# EAGLE design atmega32u4-breakout-v2 (EAGLE 5.10)
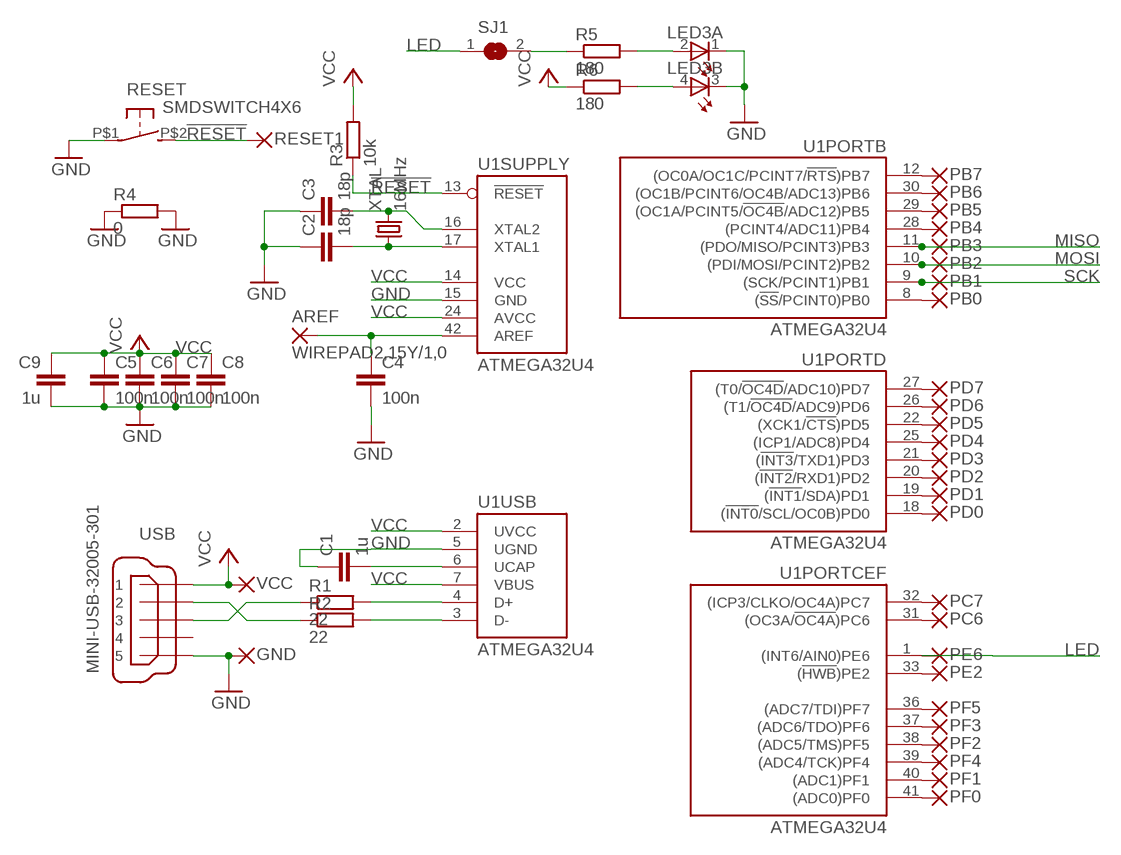
[diagram p0: schematic, sheet 1]

## Parts
AREF  WIREPAD2,15Y/1,0  [2,15Y/1,0]
C1  1u  C-EUC0603  [C0603]
C2  18p  C-EUC0603  [C0603]
C3  18p  C-EUC0603  [C0603]
C4  100n  C-EUC0603  [C0603]
C5  100n  C-EUC0603  [C0603]
C6  100n  C-EUC0603  [C0603]
C7  100n  C-EUC0603  [C0603]
C8  100n  C-EUC0603  [C0603]
C9  1u  C-EUC0603K  [C0603K]
GND  WIREPAD2,15Y/1,0  [2,15Y/1,0]
LED3  TOPLED-2-/  [P-LCC-4/2]
PB0  WIREPAD2,15Y/1,0  [2,15Y/1,0]
PB1  WIREPAD2,15Y/1,0  [2,15Y/1,0]
PB2  WIREPAD2,15Y/1,0  [2,15Y/1,0]
PB3  WIREPAD2,15Y/1,0  [2,15Y/1,0]
PB4  WIREPAD2,15Y/1,0  [2,15Y/1,0]
PB5  WIREPAD2,15Y/1,0  [2,15Y/1,0]
PB6  WIREPAD2,15Y/1,0  [2,15Y/1,0]
PB7  WIREPAD2,15Y/1,0  [2,15Y/1,0]
PC6  WIREPAD2,15Y/1,0  [2,15Y/1,0]
PC7  WIREPAD2,15Y/1,0  [2,15Y/1,0]
PD0  WIREPAD2,15Y/1,0  [2,15Y/1,0]
PD1  WIREPAD2,15Y/1,0  [2,15Y/1,0]
PD2  WIREPAD2,15Y/1,0  [2,15Y/1,0]
PD3  WIREPAD2,15Y/1,0  [2,15Y/1,0]
PD4  WIREPAD2,15Y/1,0  [2,15Y/1,0]
PD5  WIREPAD2,15Y/1,0  [2,15Y/1,0]
PD6  WIREPAD2,15Y/1,0  [2,15Y/1,0]
PD7  WIREPAD2,15Y/1,0  [2,15Y/1,0]
PE2  WIREPAD2,15Y/1,0  [2,15Y/1,0]
PE6  WIREPAD2,15Y/1,0  [2,15Y/1,0]
PF0  WIREPAD2,15Y/1,0  [2,15Y/1,0]
PF1  WIREPAD2,15Y/1,0  [2,15Y/1,0]
PF2  WIREPAD2,15Y/1,0  [2,15Y/1,0]
PF3  WIREPAD2,15Y/1,0  [2,15Y/1,0]
PF4  WIREPAD2,15Y/1,0  [2,15Y/1,0]
PF5  WIREPAD2,15Y/1,0  [2,15Y/1,0]
R1  22  R-EU_R0603  [R0603]
R2  22  R-EU_R0603  [R0603]
R3  10k  R-EU_R0603  [R0603]
R4  0  R-EU_R0603  [R0603]
R5  180  R-EU_R0603  [R0603]
R6  180  R-EU_R0603  [R0603]
RESET  SMDSWITCH4X6  [SWSMD4X6]
RESET1  WIREPAD2,15Y/1,0  [2,15Y/1,0]
SJ1  SJ  [SJ]
U1  ATMEGA32U4  ATMEGAXU4  [TQFP44]
USB  MINI-USB-32005-301  [32005-301]
VCC  WIREPAD2,15Y/1,0  [2,15Y/1,0]
XTAL  16MHz  CRYSTALCS10  [CS10]

## Nets
!RESET: R3.1 RESET1.1(P) RESET.P$2(S) U1.13(SUPPLY:!RESET)
AREF: AREF.1(P) C4.1 U1.42(SUPPLY:AREF)
GND: C1.1 C2.1 C3.1 C4.2 C5.2 C6.2 C7.2 C8.2 C9.2 GND.1(P) LED3.1(A:C) LED3.3(B:C) R4.1 R4.2 RESET.P$1(P) U1.5(USB:UGND) U1.15(SUPPLY:GND) USB.5
LED: PE6.1(P) SJ1.1 U1.1(PORTCEF:(INT6/AIN0)PE6)
MISO: PB3.1(P) U1.11(PORTB:(PDO/MISO/PCINT3)PB3)
MOSI: PB2.1(P) U1.10(PORTB:(PDI/MOSI/PCINT2)PB2)
N$1: R1.1 USB.3
N$2: R2.1 USB.2
N$3: PB0.1(P) U1.8(PORTB:(!SS!/PCINT0)PB0)
N$4: R5.1 SJ1.2
N$5: C2.2 U1.17(SUPPLY:XTAL1) XTAL.P$1
N$6: C3.2 U1.16(SUPPLY:XTAL2) XTAL.P$2
N$7: C1.2 U1.6(USB:UCAP)
N$8: LED3.2(A:A) R5.2
N$9: R1.2 U1.4(USB:D+)
N$10: R2.2 U1.3(USB:D-)
N$11: LED3.4(B:A) R6.2
N$12: PD5.1(P) U1.22(PORTD:(XCK1/!CTS!)PD5)
N$13: PB4.1(P) U1.28(PORTB:(PCINT4/ADC11)PB4)
N$14: PB5.1(P) U1.29(PORTB:(OC1A/PCINT5/!OC4B!/ADC12)PB5)
N$15: PF0.1(P) U1.41(PORTCEF:(ADC0)PF0)
N$16: PF1.1(P) U1.40(PORTCEF:(ADC1)PF1)
N$17: PF4.1(P) U1.39(PORTCEF:(ADC4/TCK)PF4)
N$18: PF2.1(P) U1.38(PORTCEF:(ADC5/TMS)PF5)
N$19: PF3.1(P) U1.37(PORTCEF:(ADC6/TDO)PF6)
N$20: PF5.1(P) U1.36(PORTCEF:(ADC7/TDI)PF7)
N$21: PE2.1(P) U1.33(PORTCEF:(!HWB!)PE2)
N$23: PC6.1(P) U1.31(PORTCEF:(OC3A/!OC4A!)PC6)
N$24: PC7.1(P) U1.32(PORTCEF:(ICP3/CLKO/OC4A)PC7)
N$25: PB6.1(P) U1.30(PORTB:(OC1B/PCINT6/OC4B/ADC13)PB6)
N$26: PB7.1(P) U1.12(PORTB:(OC0A/OC1C/PCINT7/!RTS!)PB7)
N$27: PD0.1(P) U1.18(PORTD:(!INT0!/SCL/OC0B)PD0)
N$28: PD1.1(P) U1.19(PORTD:(!INT1!/SDA)PD1)
N$29: PD2.1(P) U1.20(PORTD:(!INT2!/RXD1)PD2)
N$30: PD3.1(P) U1.21(PORTD:(!INT3!/TXD1)PD3)
N$31: PD4.1(P) U1.25(PORTD:(ICP1/ADC8)PD4)
N$33: PD6.1(P) U1.26(PORTD:(T1/!OC4D!/ADC9)PD6)
N$34: PD7.1(P) U1.27(PORTD:(T0/!OC4D!/ADC10)PD7)
SCK: PB1.1(P) U1.9(PORTB:(SCK/PCINT1)PB1)
VCC: C5.1 C6.1 C7.1 C8.1 C9.1 R3.2 R6.1 U1.2(USB:UVCC) U1.7(USB:VBUS) U1.14(SUPPLY:VCC) U1.24(SUPPLY:AVCC) USB.1 VCC.1(P)
Unconnected: USB.4

## Power pins joined to a net without a drawn wire
GND: U1.23(GND) U1.35(GND) U1.43(GND)
VCC: U1.34(VCC) U1.44(AVCC)

## Library data of the parts
AREF GND PB0 PB1-PB7 PC6 PC7 PD0 PD1-PD7 PE2 PE6 PF0 PF1-PF5 RESET1 VCC = jocki:WIREPAD: Wire PAD connect wire on PCB
C1-C9 = rcl:C-EU: CAPACITOR, European symbol
LED3 = jocki:TOPLED-2-: Multi TOPLED® (two color) LG T672, LP T672 LSY T67B LSW T67C LSY T675 LSY T676 LSG T677 LSG T770 Source: http://www.osram.convergy.de/
R1-R6 = rcl:R-EU_: RESISTOR, European symbol
RESET = jocki:SMDSWITCH
SJ1 = jumper:SJ: SMD solder JUMPER
U1 = jocki:ATMEGAXU4: Atmel Atmega16U4 or Atmega32U4
USB = jocki:MINI-USB-: MINI USB-B Conector Source: www.cypressindustries.com
XTAL = jocki:CRYSTAL

## Board
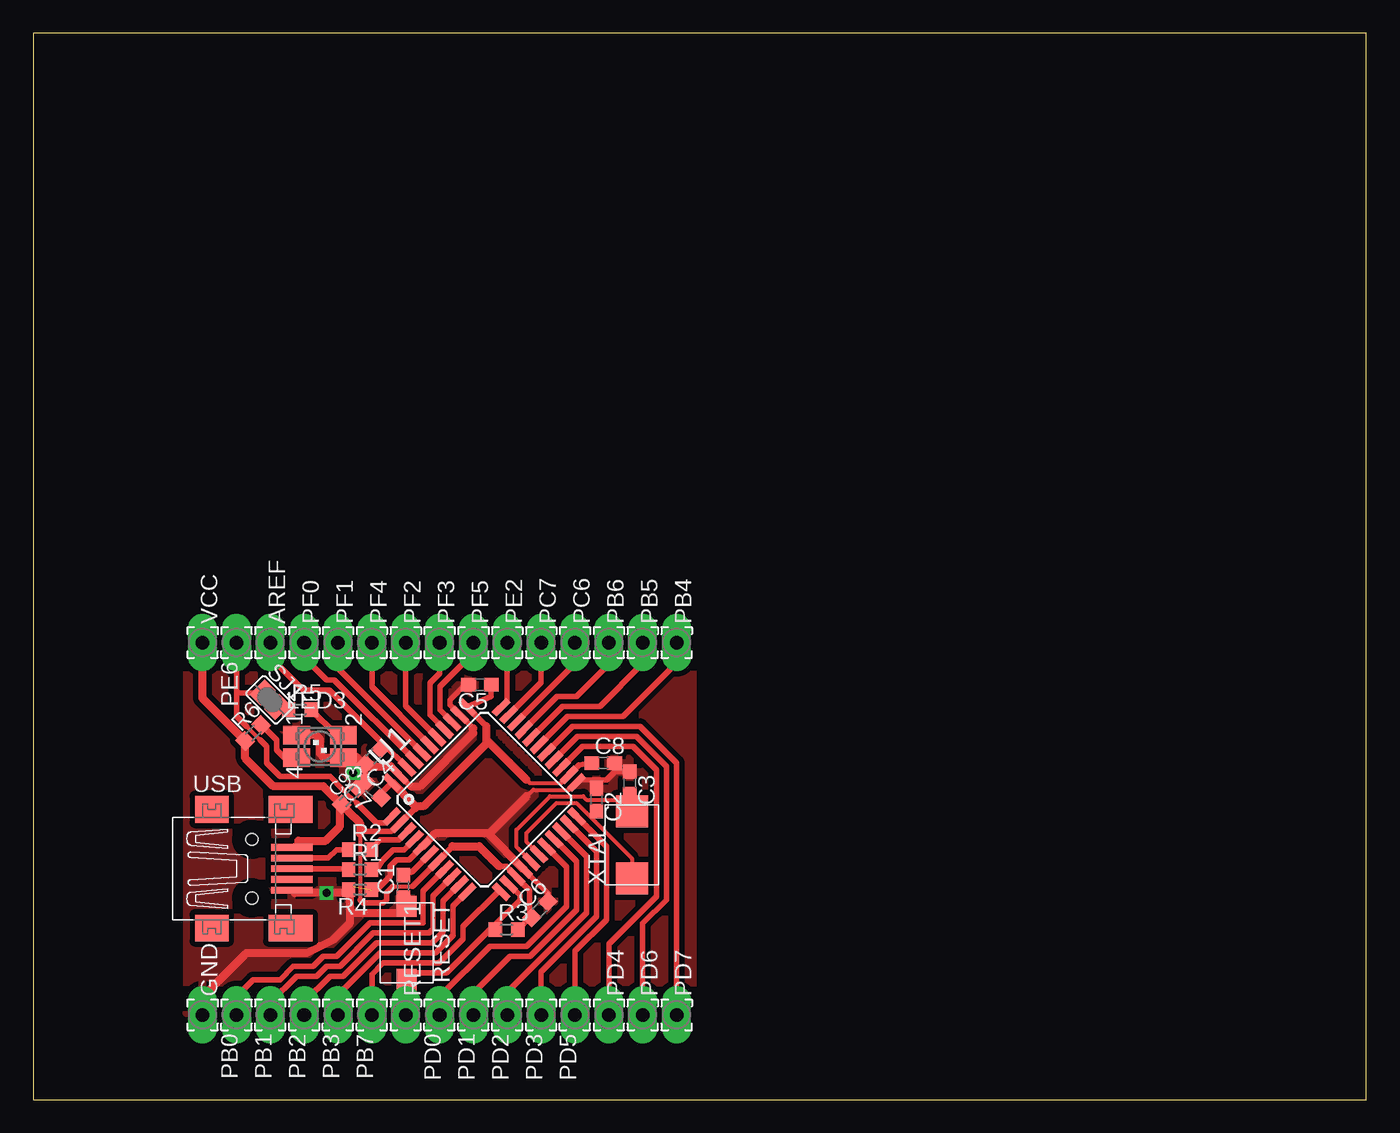
[diagram p1: board, top side]
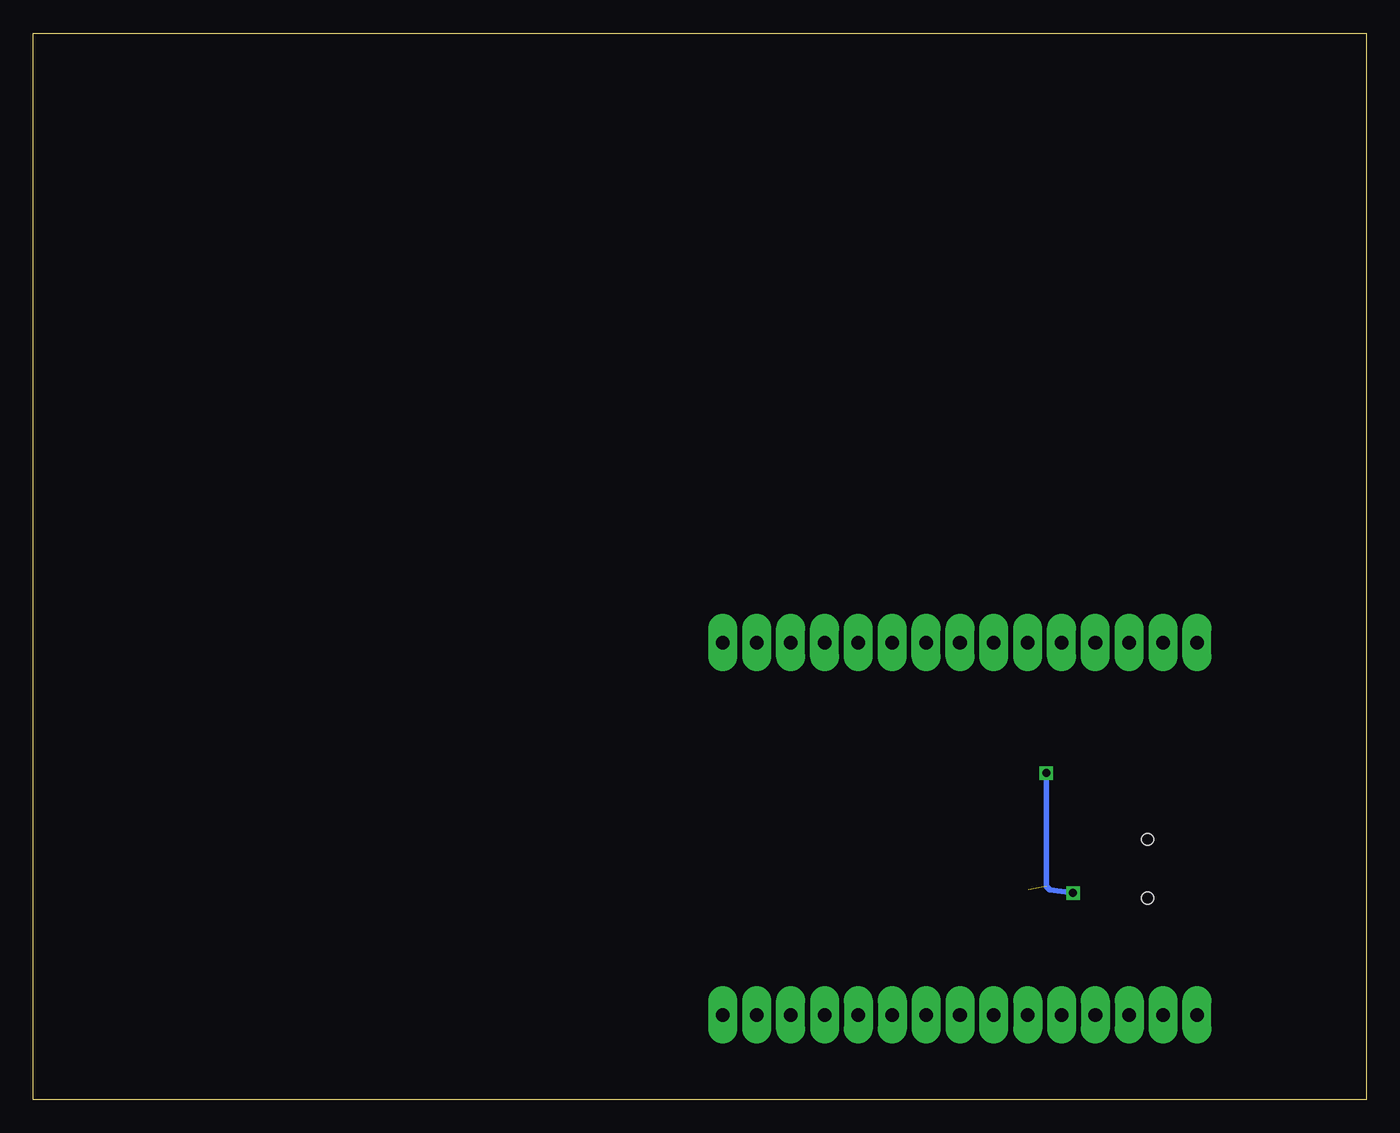
[diagram p2: board, bottom side, seen from below]

Size 100 x 80 mm. Coordinates in mm from the lower left corner, seen from the top.
Outline: 0,0 100,0 100,80 0,80 0,0
Copper layers (1*16): Top 0.035mm / dielectric 1.5mm / Bottom 0.035mm
Design rules "default *": minimum track width 10mil, minimum drill 24mil, track to track 8mil, track to pad 8mil, pad to pad 8mil, via to via 8mil, smd to smd 8mil, copper to edge 40mil, drill to drill 8mil, minimum pad ring 10mil, minimum via ring 8mil, stop-mask expansion 4mil, vias tented up to drill 0mil, thermal gap 16mil

### Footprints (pad centres in the part's own frame; a part is rotated, then mirrored left to right if it is on the bottom)
2,15Y/1,0 = drill 1.016 pad 2.159 long: 1 0,0
C0603 = smd 1.1 x 1: 1 -0.85,0; 2 0.85,0
C0603K = smd 1.05 x 1.08: 1 -0.875,0; 2 0.875,0
P-LCC-4/2 = smd 1.4 x 2: 1 -0.85,-1.75; 2 -0.85,1.75; 3 0.85,1.75; 4 0.85,-1.75
R0603 = smd 1 x 1.1: 1 -0.85,0; 2 0.85,0
SWSMD4X6 = smd 1.6 x 1.5: P$1 -2.75,0; P$2 2.75,0
SJ = smd 1.168 x 1.6: 1 -0.762,0; 2 0.762,0
TQFP44 = smd 1.5 x 0.5: 1 -5.8,4; 2 -5.8,3.2; 3 -5.8,2.4; 4 -5.8,1.6; 5 -5.8,0.8; 6 -5.8,0; 7 -5.8,-0.8; 8 -5.8,-1.6; 9 -5.8,-2.4; 10 -5.8,-3.2; 11 -5.8,-4; 23 5.8,-4; 24 5.8,-3.2; 25 5.8,-2.4; 26 5.8,-1.6; 27 5.8,-0.8; 28 5.8,0; 29 5.8,0.8; 30 5.8,1.6; 31 5.8,2.4; 32 5.8,3.2; 33 5.8,4 | smd 0.5 x 1.5: 12 -4,-5.8; 13 -3.2,-5.8; 14 -2.4,-5.8; 15 -1.6,-5.8; 16 -0.8,-5.8; 17 0,-5.8; 18 0.8,-5.8; 19 1.6,-5.8; 20 2.4,-5.8; 21 3.2,-5.8; 22 4,-5.8; 34 4,5.8; 35 3.2,5.8; 36 2.4,5.8; 37 1.6,5.8; 38 0.8,5.8; 39 0,5.8; 40 -0.8,5.8; 41 -1.6,5.8; 42 -2.4,5.8; 43 -3.2,5.8; 44 -4,5.8
32005-301 = smd 3.1 x 0.5: 1 3,1.6; 2 3,0.8; 3 3,0; 4 3,-0.8; 5 3,-1.6 | smd 2.5 x 2: M1 -3,-4.45; M2 -3,4.45 | smd 3.3 x 2: M3 2.9,4.45; M4 2.9,-4.45 | drill 0.127 pad 0.508 round: P$1 0,2.21; P$2 0,-2.21 | hole 0.9: 0,2.2; 0,-2.2
CS10 = smd 2.4 x 2.4: P$1 -2.5,0; P$2 2.5,0

### Placement (x,y rotation side)
AREF  17.78,34.29 90 top
C1  27.75,16 90 top
C2  42.25,22.5 270 top
C3  44.75,23.75 270 top
C4  25.5,25.75 225 top
C5  33.51,31.12 180 top
C6  38,14.25 45 top
C7  25.5,23.25 135 top
C8  42.75,25.25 0 top
C9  23.75,22.75 45 top
GND  12.7,6.35 90 top
LED3  21.5,26.5 270 top
PB0  15.24,6.35 270 top
PB1  17.78,6.35 270 top
PB2  20.32,6.35 270 top
PB3  22.86,6.35 270 top
PB4  48.26,34.29 90 top
PB5  45.72,34.29 90 top
PB6  43.18,34.29 90 top
PB7  25.4,6.35 270 top
PC6  40.64,34.29 90 top
PC7  38.1,34.29 90 top
PD0  30.48,6.35 270 top
PD1  33.02,6.35 270 top
PD2  35.56,6.35 270 top
PD3  38.1,6.35 270 top
PD4  43.18,6.35 90 top
PD5  40.64,6.35 270 top
PD6  45.72,6.35 90 top
PD7  48.26,6.35 90 top
PE2  35.56,34.29 90 top
PE6  15.24,34.29 270 top
PF0  20.32,34.29 90 top
PF1  22.86,34.29 90 top
PF2  27.94,34.29 90 top
PF3  30.48,34.29 90 top
PF4  25.4,34.29 90 top
PF5  33.02,34.29 90 top
R1  24.5,17.25 0 top
R2  24.5,18.75 0 top
R3  35.5,12.75 0 top
R4  24.5,15.75 180 top
R5  20,29.25 0 top
R6  16.5,27.5 45 top
RESET  28,11.75 270 top
RESET1  27.94,6.35 90 top
SJ1  17.75,30 315 top
U1  33.83,22.51 45 top
USB  16.39,17.32 0 top
VCC  12.7,34.29 90 top
XTAL  44.91,19.11 90 top

### Tracks (layer width: path | path; a pad name or v marks a point on that pad's centre or on a via)
!RESET
  Top 0.406: RESET1.1 27.94,8.94 RESET.P$2 28.5,9.5 31,9.5 34.65,13.15 | U1.13 36.5,15.31 36.5,15 34.65,13.15 | 34.65,13.15 R3.1
AREF
  Top 0.406: 26.22,26.72 22.2,30.75 20.25,30.75 17.78,33.22 AREF.1 | 26.22,26.72 U1.42 | C4.1 26.1,26.6 arc-90 26.22,26.72
GND  (via drill 0.6)  (1 unrouted)
  Top 0.305: U1.23 40.23,23.25 37.5,23.25 37,22.75 | 19.61,15.5 USB.5
  Top 0.406: 28.31,23.5 U1.43 26.81,25 | 33,27.86 U1.35 31.25,29.61 31.25,30 32.47,31.22 C5.2 | 34.08,20 34.25,20 | U1.23 40.98,24 42.5,24 | 42.5,24 43,24 43.6,24.6 | 43.6,24.6 C8.2 | C2.1 42.5,23.6 42.5,24 | 43.6,24.6 C3.1 | C4.2 arc90 25.05,25 | C4.2 C7.2 C9.2 | C6.2 38.6,15.48 U1.15 | U1.5 28.19,18 27.25,18 26.75,17.5 26.75,16.75 25.75,15.75 R4.1 | C1.1 27.75,14.75 RESET.P$1 28,14 | 23.75,15.65 R4.2 | 24.52,25.52 C4.2 | 24.52,25.52 24.24,25.81 | 24,25.52 23,25.52 23.12,25.65 LED3.3 | 24,25.52 24.52,25.52 | v24,24.5 24,25.52 | USB.5 19.42,15.75
  Top 0.61: 28.31,23.5 29,23.5 33,27.5 33,27.86 | U1.5 30.19,20 34.08,20 U1.15 | 34.25,20 37,22.75 | 25.05,25 26.81,25 | 23.75,15.65 23.75,14.75 23.75,14 | 23.75,14 28,14 | GND.1 12.7,7.7 16,11 20.5,11 21.5,11.5 22.5,12 23.75,13.25 23.75,14 | R4.2 23.5,15.5 v22,15.5 19.61,15.5 | LED3.1 21.18,27.35 21.5,27.03 21.5,25.97 21.82,25.65 LED3.3
  Bottom 0.406: v24,24.5 24,16 23.75,15.75 v22,15.5
  pour Top (isolate 0.406): 11.5,34.5 11.5,6.5 49.5,6.5 49.5,34.5
LED
  Top 0.305: 23.25,23.25 24.25,22.25 | 17,27 16,28
  Top 0.406: 15.24,30.5 PE6.1 | U1.1 26.41,20.75 25.75,20.75 24.25,22.25 | SJ1.1 16.92,30.5 15.24,30.5 | 23.25,23.25 22.25,24.25 18.5,24.25 17.5,25.25 17.5,26.5 17,27 | 16,28 15.24,28.76 15.24,30.5
MISO
  Top 0.406: U1.11 31.5,14.52 31.5,12.32 30.18,11 26,11 22.86,7.86 PB3.1
MOSI
  Top 0.406: U1.10 30.75,14.9 30.75,12.57 29.93,11.75 25.75,11.75 23.25,9.25 22.25,9.25 20.32,7.32 PB2.1
N$1
  Top 0.406: USB.3 23.58,17.32 arc-90 R1.1
N$2
  Top 0.406: USB.2 22.12,18.12 22.75,18.75 R2.1
N$3
  Top 0.406: U1.8 29.25,15.67 29.25,13.25 25.25,13.25 22.75,10.75 21.75,10.75 21,10 19.5,10 18.5,9 16.5,9 15.24,7.74 PB0.1
N$4
  Top 0.406: R5.1 18.69,29.71 SJ1.2
N$5
  Top 0.305: U1.17 37,19.34 37,20 39.25,22.25 40.75,22.25 41.75,21.25 | 41.75,21.25 44.91,18.09 XTAL.P$1 | C2.2 41.85,21.25 41.75,21.25
N$6
  Top 0.305: U1.16 36.25,18.96 36.25,20.25 38.75,22.75 41.25,22.75 41.5,22.5 44.5,22.5
  Top 0.406: 44.5,22.5 44.75,22.75 C3.2 44.75,21.77 XTAL.P$2
N$7
  Top 0.406: U1.6 28.42,17.1 C1.2
N$8
  Top 0.406: R5.2 22.75,27.35 LED3.2
N$9
  Top 0.406: U1.4 27.81,18.75 27,18.75 26.25,18 25.75,17.25 R1.2 25.5,17.25
N$10
  Top 0.406: U1.3 27.43,19.5 26,19.5 25.35,18.85 R2.2
N$11
  Top 0.406: LED3.4 19.6,25.5 19,25.5 18.25,26.25 18.25,27 17.15,28.1 R6.2
N$12
  Top 0.406: PD5.1 40.64,11.14 43,13.5 43,19 U1.22
N$13
  Top 0.406: U1.28 40.07,28.75 44.25,28.75 48.26,32.76 PB4.1
N$14
  Top 0.406: U1.29 39.69,29.5 42.5,29.5 45.72,32.72 PB5.1
N$15
  Top 0.406: U1.41 22.58,31.5 22,31.5 20.32,33.18 PF0.1
N$16
  Top 0.406: U1.40 22.86,32.35 PF1.1
N$17
  Top 0.406: U1.39 25.4,30.94 PF4.1
N$18
  Top 0.406: U1.38 27.94,29.53 PF2.1
N$19
  Top 0.406: U1.37 29.75,28.85 29.75,31.25 30.48,31.98 PF3.1
N$20
  Top 0.406: U1.36 30.5,29.23 30.5,31 33.02,33.52 PF5.1
N$21
  Top 0.406: U1.33 35.56,29.9 PE2.1
N$23
  Top 0.406: U1.31 40.64,32.71 PC6.1
N$24
  Top 0.406: U1.32 38.1,31.3 PC7.1
N$25
  Top 0.406: U1.30 39.31,30.25 40.75,30.25 43.18,32.68 PB6.1
N$26
  Top 0.406: PB7.1 25.4,9.4 26.25,10.25 30.43,10.25 32.25,12.07 32.25,12.98 34.85,15.58 U1.12
N$27
  Top 0.406: PD0.1 30.48,7.73 34.25,11.5 37,11.5 40,14.5 40,17.47 U1.18
N$28
  Top 0.406: PD1.1 33.02,8.02 35.75,10.75 37.25,10.75 40.75,14.25 40.75,17.85 U1.19
N$29
  Top 0.406: PD2.1 35.56,8.06 41.5,14 41.5,18.23 U1.20
N$30
  Top 0.406: PD3.1 38.1,9.6 42.25,13.75 42.25,18.61 U1.21
N$31
  Top 0.406: U1.25 41.21,26.5 45,26.5 46.75,24.75 46.75,15.25 43.18,11.68 PD4.1
N$33
  Top 0.406: U1.26 40.83,27.25 45.25,27.25 47.5,25 47.5,15 45.72,13.22 PD6.1
N$34
  Top 0.406: U1.27 40.45,28 45.5,28 48.25,25.25 PD7.1
SCK
  Top 0.406: U1.9 30,15.29 30,12.82 29.68,12.5 25.5,12.5 23,10 22,10 21.25,9.25 19.75,9.25 17.78,7.28 PB1.1
VCC
  Top 0.305: U1.24 39.6,23.75 37.25,23.75 37,24 | 27,16 28.45,16 | 24.5,19.93 24.5,15 | USB.1 19.89,19.42
  Top 0.406: 34,28 U1.34 34.35,30.24 C5.1 | 31.45,19 U1.7 28.45,16 | 34,26.71 34,27 | C7.1 26.02,22.9 U1.44 | U1.24 40.95,25.1 C8.1 | 37.5,13.5 37.5,13.55 C6.1 37.25,13.65 | 37.25,13.65 R3.2 | 37.25,13.65 37.25,15.7 U1.14 35.5,17.5 34.95,17.5 | 24.5,15 24.75,14.75 26.25,14.75 26.5,15 26.5,15.5 27,16 | 24.5,19.93 arc-90 24.68,20.11 26.86,20.11 27.42,20.67 U1.2 28.65,21.85 | 23,22 C9.1
  Top 0.61: 34,28 34,26.71 29.4,22.1 29.33,22.04 28.65,22.04 | 31.45,19 33.45,19 34.95,17.5 | 28.65,22.04 U1.44 | 34,27 37,24 | 24.5,19.93 24.5,20.75 23.62,21.63 C9.1 22.62,22.63 21.75,23.5 18,23.5 15.9,25.6 R6.1 12.7,30.1 VCC.1 | 23,22 23,20.5 21.92,19.42 19.89,19.42 | 28.65,21.85 28.65,22.04

### Text on the board
Reference: PE6 | REF | 0 | 1 | 4 | 2 | 3 | 5 | PC7 | PC6 | PB6 | PB5 | PB4 | PE2 | PE6 | PF | VDD | POWER | PB | PD | GND | RESET | 0 | 1 | 2 | 3 | 7 | 0 | 1 | 2 | 3 | 5 | 4 | 6 | 7